# EAGLE schematic BeeCee (EAGLE 7.5.0)
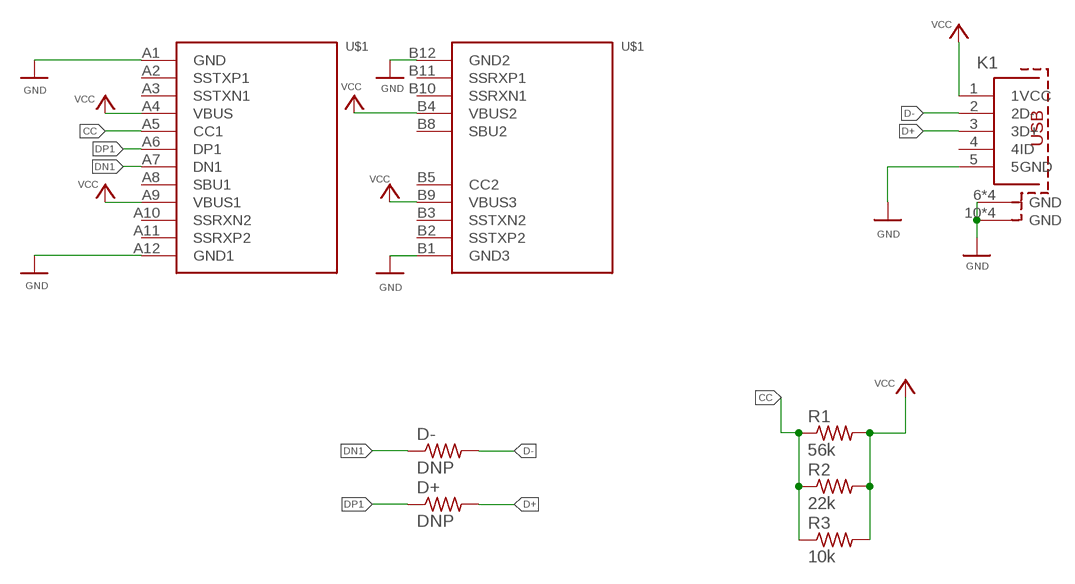
[diagram p0: schematic, sheet 1]

## Parts
D+  DNP  R-US_R0805  [R0805]
D-  DNP  R-US_R0805  [R0805]
K1  629105150921  [629105150921]
R1  56k  R-US_R0805  [R0805]
R2  22k  R-US_R0805  [R0805]
R3  10k  R-US_R0805  [R0805]
U$1  632712000011(T)  [632712000011]

## Nets
CC: R1.1 R2.1 R3.1 U$1.A5(CC1)
D+: D+.2 K1.3(3D+)
D-: D-.2 K1.2(2D-)
DN1: D-.1 U$1.A7(DN1)
DP1: D+.1 U$1.A6(DP1)
GND: K1.5(5GND) K1.6(GND) K1.7(GND) K1.8(GND) K1.9(GND) K1.10(GND) K1.11(GND) K1.12(GND) K1.13(GND) U$1.A1(GND) U$1.A12(GND1) U$1.B1(GND3) U$1.B12(GND2)
VCC: K1.1(1VCC) R1.2 R2.2 R3.2 U$1.A4(VBUS) U$1.A9(VBUS1) U$1.B4(VBUS2) U$1.B9(VBUS3)
Unconnected: K1.4(4ID) U$1.A2(SSTXP1) U$1.A3(SSTXN1) U$1.A8(SBU1) U$1.A10(SSRXN2) U$1.A11(SSRXP2) U$1.B2(SSTXP2) U$1.B3(SSTXN2) U$1.B5(CC2) U$1.B8(SBU2) U$1.B10(SSRXN1) U$1.B11(SSRXP1)

## Library data of the parts
D+ D- R1-R3 = adafruit:R-US_: RESISTOR, American symbol
K1 = Eagle_INPUT_OUTPUT_CONNECTORS_rev15d:629105150921: WR-COM_USB_Micro Type AB_Horizontal_SMT ; Micro Type AB Horizontal SMT - with Pegs - T&R Packaging Code : Con_I-O_COM_USB_2.0_AB_629105150921_629105150921 <http://katalog.we-online.de/media/images/eican/Con_I-O_COM_USB_2.0_AB_629105150921_pf2.jpg> Details see: http://katalog.we-online.de/em/datasheet/629105150921.pdf Created 12/08/2014, Dan Xu 2014 (C) Wurth Elektronik
U$1 = Eagle_INPUT_OUTPUT_CONNECTORS_rev15d:632712000011: USB 3.1 TYPE C PLUG - HORIZONTAL SMT =>ConUSB31 632712000011 Characteristics INSULATOR: LCP FLAMMABILITY RATING: UL94-V0 COLOR: BLACK CONTACT MATERIAL: COPPER ALLOY CONTACT PLATING: 2μ’’ GOLD OVER 30μ’’ Pd-Ni COVER MATERIAL: STEEL COVER PLATING: Ni QUALITY CLASS: 10 000 MATING CYCLES OPERATING TEMPERATURE:-25°C UP TO +105°C COMPLIANCE: LEAD FREE AND ROHS ELECTRICAL CURRENT RATING: 3 A MAX WORKING VOLTAGE: 5 VDC WITHSTANDING VOLTAGE: 100 VAC/MIN INSULATION RESISTANCE: >1000 MΩ CONTACT RESISTANCE: 30 mΩ MAX MECHANICAL INSERTION FORCE: 5-8 N MAX EXTRACTION FORCE: 8-20 N MIN <http://katalog.we-online.de/media/images/v2/Family_WR-COM_632712000011_4C.jpg> Details see: http://katalog.we-online.de/en/em/COM_3_1_SMT_TYPE_C_PLUG_HORIZONTAL/632712000011? 2015 (C) Wurth Elektronik